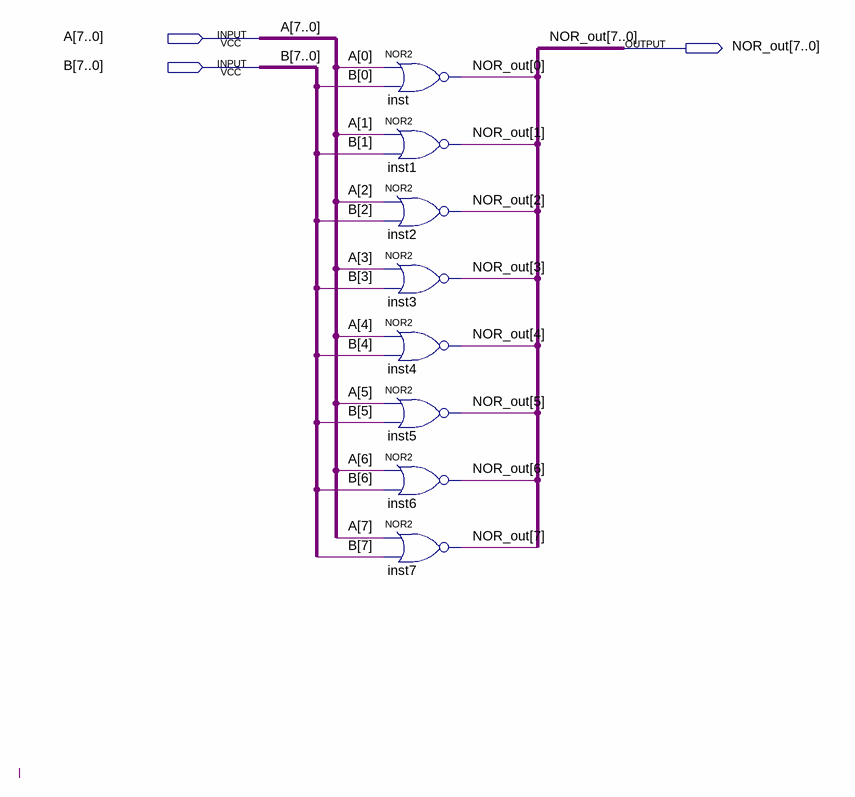
[diagram p0: schematic sheet]
// Quartus schematic NOR.bdf as structural Verilog: 8 symbols, 3 pins
module NOR (
  input  [7:0] A,
  input  [7:0] B,
  output [7:0] NOR_out
);

  nor inst (NOR_out[0], A[0], B[0]);
  nor inst1 (NOR_out[1], A[1], B[1]);
  nor inst2 (NOR_out[2], A[2], B[2]);
  nor inst3 (NOR_out[3], A[3], B[3]);
  nor inst4 (NOR_out[4], A[4], B[4]);
  nor inst5 (NOR_out[5], A[5], B[5]);
  nor inst6 (NOR_out[6], A[6], B[6]);
  nor inst7 (NOR_out[7], A[7], B[7]);
endmodule
